# Altium schematic sheet sch_psoc.SchDoc: Microcontrôleur PSoC 4
size A4; CheckedBy: Q.V. Nguyen; Author: Q.V. Nguyen, C. Demasson; DrawnBy: Q.V. Nguyen, C. Demasson; Organization: CNES; Revision: 0; SheetNumber: 3; SheetTotal: 4; ProjectName: EYE-SAT
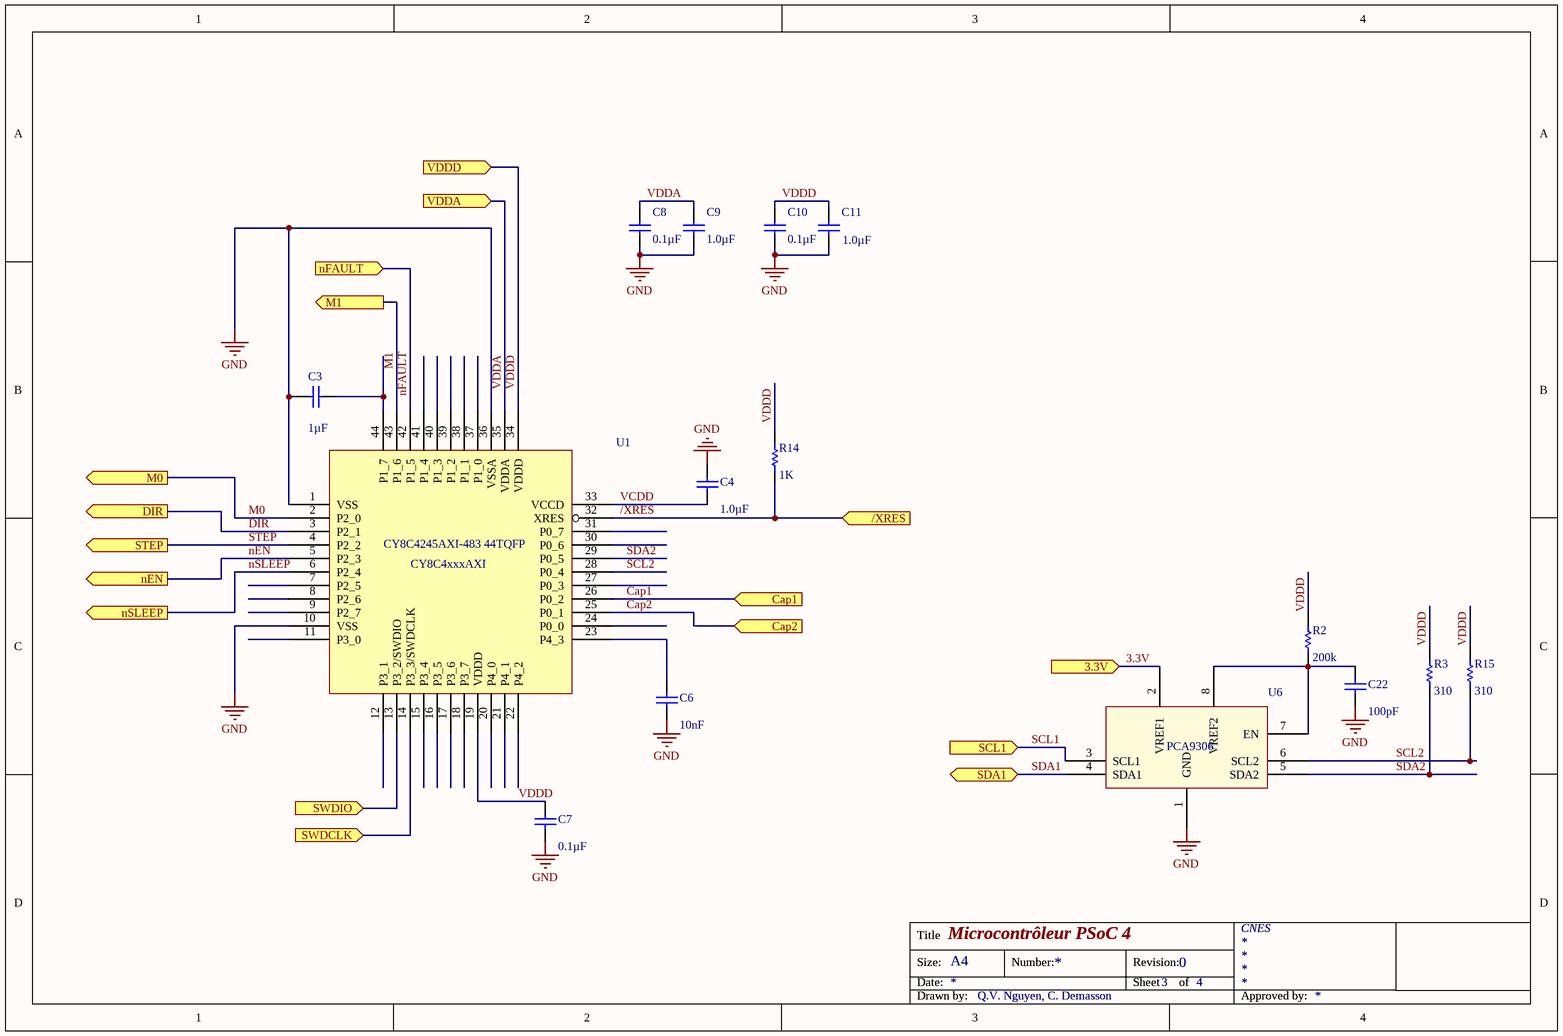
[diagram p0: sch_psoc.SchDoc]

## Parts
C3  value 1µF  [C1206]
C4  value 1.0µF  [C1206]
C6  value 10nF  [C1206]
C7  value 0.1µF  [C1206]
C8  value 0.1µF  [C1206]
C9  value 1.0µF  [C1206]
C10  value 0.1µF  [C1206]
C11  value 1.0µF  [C1206]
C22  value 100pF  [C1206]
R2  value 200k  [C1206]  (hidden comment: R2)
R3  value 310  [C1206]
R14  value 1K  [C1206]
R15  value 310  [C1206]
U1  CY8C4245AXI-483 44TQFP  [CY8C4xxxAXI]
U6  PCA9306  [VSSOP8]

## Ports
3.3V (in), /XRES (in), Cap1 (in), Cap2 (in), DIR (out), M0 (out), M1 (out), nEN (out), nFAULT (in), nSLEEP (out), SCL1 (in), SDA1 (bidir), STEP (out), SWDCLK (in), SWDIO (in), VDDA (in), VDDD (in)

## Nets
GND: C3.2 C4.1 C6.1 C7.1 C8.1 C9.1 C10.1 C11.1 C22.1 U1.1(VSS) U1.10(VSS) U1.36(VSSA) U6.1(GND)
3.3V: U6.2(VREF1) ; port 3.3V
/XRES: R14.1 U1.32(XRES) ; port /XRES
Cap1: U1.26(P0_2) ; port Cap1
Cap2: U1.25(P0_1) ; port Cap2
DIR: U1.3(P2_1) ; port DIR
M0: U1.2(P2_0) ; port M0
M1: U1.43(P1_6) ; port M1
nEN: U1.5(P2_3) ; port nEN
nFAULT: U1.42(P1_5) ; port nFAULT
nSLEEP: U1.6(P2_4) ; port nSLEEP
SCL1: U6.3(SCL1) ; port SCL1
SCL2: R15.1 U1.28(P0_4) U6.6(SCL2)
SDA1: U6.4(SDA1) ; port SDA1
SDA2: R3.1 U1.29(P0_5) U6.5(SDA2)
STEP: U1.4(P2_2) ; port STEP
SWDCLK: U1.14(P3_3/SWDCLK) ; port SWDCLK
SWDIO: U1.13(P3_2/SWDIO) ; port SWDIO
VCDD: C4.2 U1.33(VCCD)
VDDA: C8.2 C9.2 U1.35(VDDA) ; port VDDA
VDDD: C7.2 C10.2 C11.2 R2.2 R3.2 R14.2 R15.2 U1.19(VDDD) U1.34(VDDD) ; port VDDD
NetC3_1: C3.1 U1.44(P1_7)
NetC6_2: C6.2 U1.23(P4_3)
NetC22_2: C22.2 R2.1 U6.7(EN) U6.8(VREF2)

Not connected (* = marked no-connect by the designer): U1 7(P2_5) 8(P2_6) 9(P2_7) 11(P3_0) 12(P3_1) 15(P3_4) 16(P3_5) 17(P3_6) 18(P3_7) 20(P4_0) 21(P4_1) 22(P4_2) 24(P0_0) 27(P0_3) 30(P0_6) 31(P0_7) 37(P1_0) 38(P1_1) 39(P1_2) 40(P1_3) 41(P1_4)

## Notes on the sheet
- Title
- Size:
- Date:
- A4
- Number:
- Revision:
- Sheet
- of
- Drawn by:
- Approved by:

## Library data of the parts
C3 C4 C6-C11 C22 = Cap Semi: Capacitor (Semiconductor SIM Model); Published: 8-Jun-2000; LatestRevisionDate: 29-May-2009; LatestRevisionNote: IPC-7351 Footprint Added.; PackageReference: C1206; Publisher: Altium Limited; PackageDescription: Chip Capacitor
R2 R3 R14 R15 = Res1: Resistor; Published: 8-Jun-2000; LatestRevisionDate: 17-Jul-2002; LatestRevisionNote: Re-released for DXP Platform.; PackageReference: AXIAL-0.3; Publisher: Altium Limited; PackageDescription: Axial Device, Thru-Hole; 2 Leads; 0.3 in Pin Spacing
U1 = CY8C4xxxAXI